# EAGLE board openvga (EAGLE 4.15), part 1 of 2
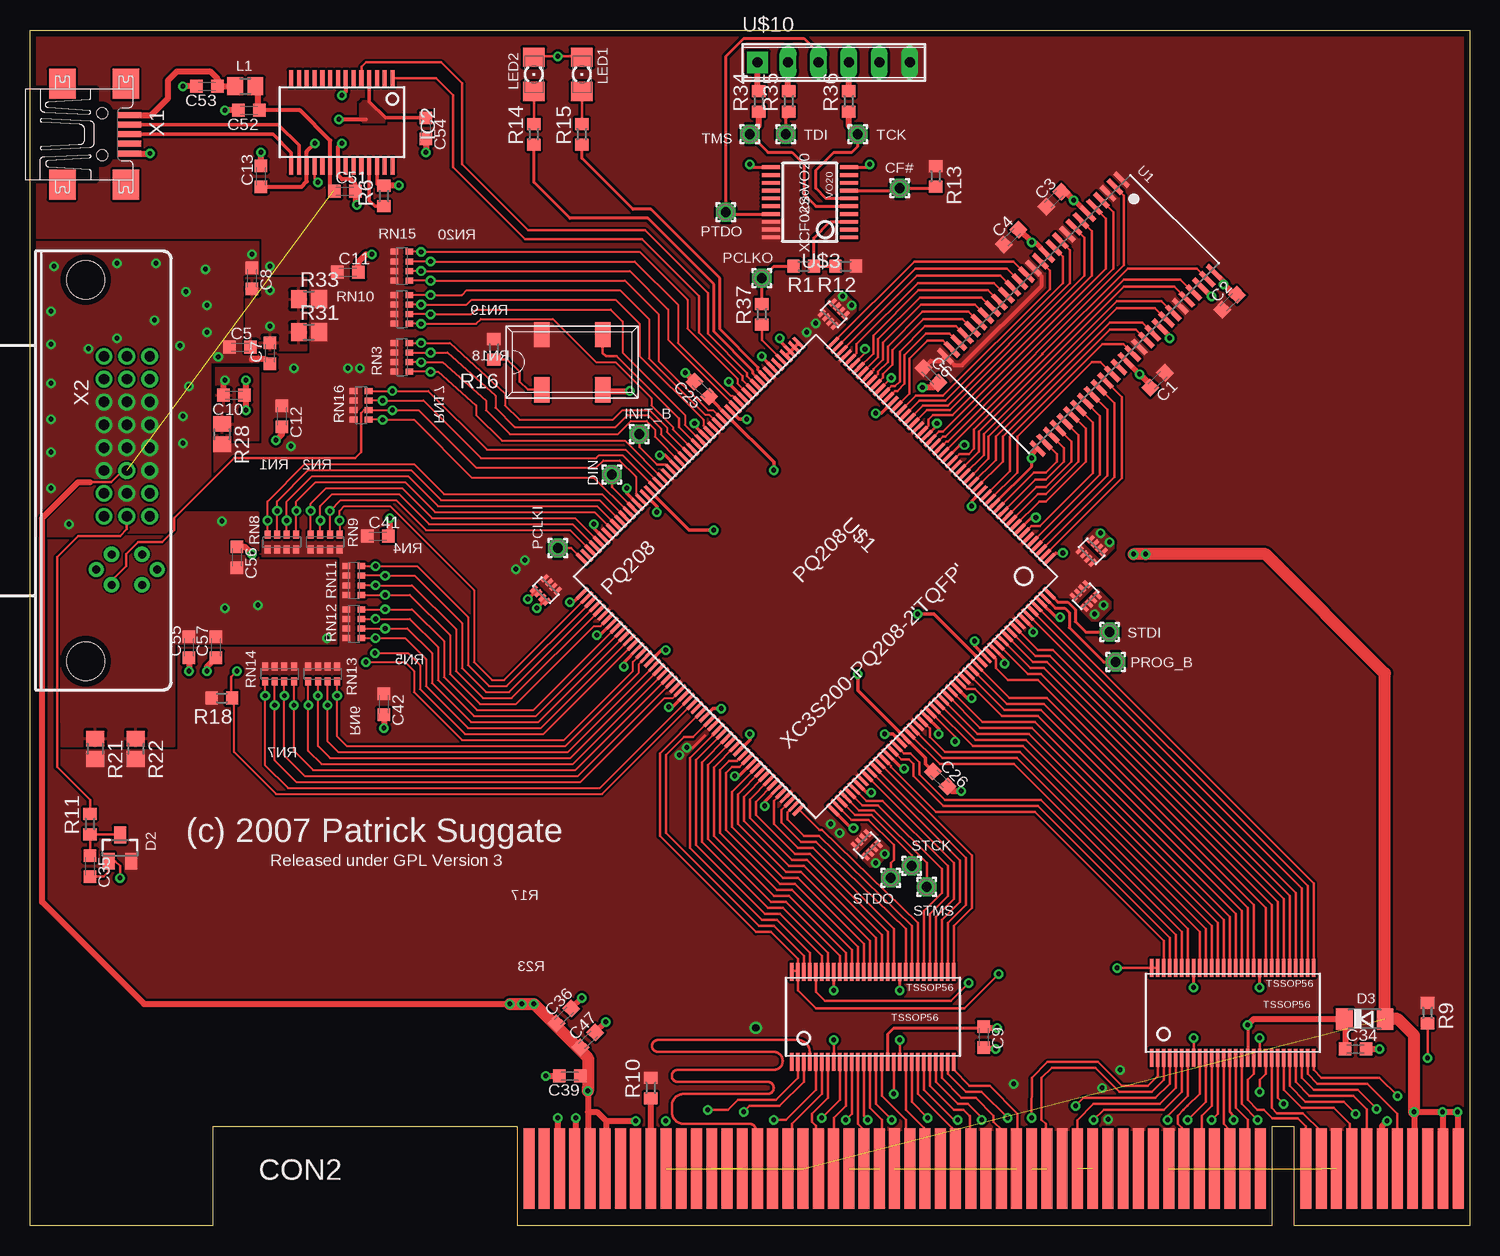
[diagram p5: board, top side]
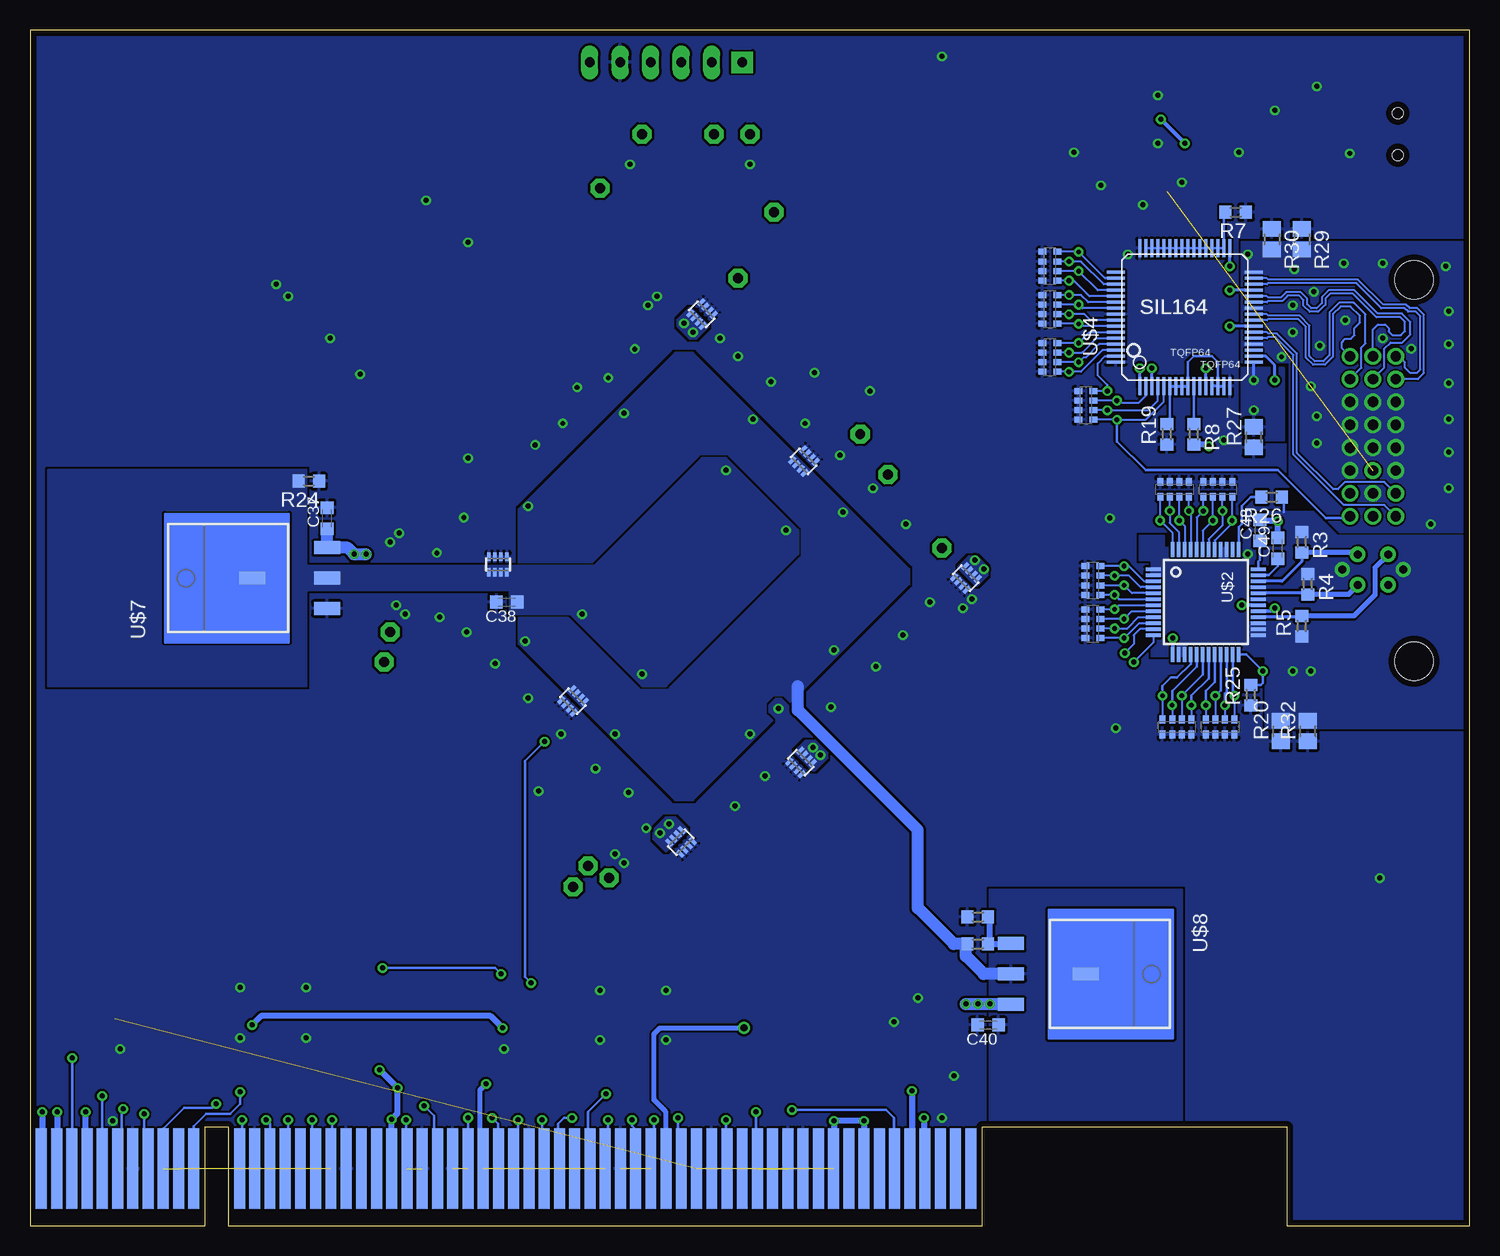
[diagram p6: board, bottom side, seen from below]

Size 120.02 x 99.69 mm. Coordinates in mm from the lower left corner, seen from the top.
Copper layers (1*16): Top 0.035mm / dielectric 1.5mm / Bottom 0.035mm
Design rules "FreeGA": minimum track width 0.15mm, minimum drill 0.4mm, track to track 0.15mm, track to pad 0.15mm, pad to pad 0.15mm, via to via 0.15mm, smd to smd 0.05mm, copper to edge 0.5mm, drill to drill 8mil, minimum pad ring 10mil, minimum via ring 8mil, stop-mask expansion 0.2mm, vias tented up to drill 0mil, thermal gap 10mil

## Footprints (pad centres in the part's own frame; a part is rotated, then mirrored left to right if it is on the bottom)
C0603K = smd 1.05 x 1.08: 1 -0.875,0; 2 0.875,0
1,6/0,8 = drill 0.813 pad 1.6 octagon: 1 0,0
CA4_0805 = smd 0.3 x 0.7: 1 -0.75,0.65; 2 -0.25,0.65; 3 0.25,0.65; 4 0.75,0.65; 5 0.75,-0.65; 6 0.25,-0.65; 7 -0.25,-0.65; 8 -0.75,-0.65
PCI_BRDL = smd 0.91 x 6.7: C1 41.593,4.763; C2 42.862,4.763; C3 44.133,4.763; C4 45.403,4.763; C5 46.672,4.763; C6 47.943,4.763; C7 49.212,4.763; C8 50.483,4.763; C9 51.752,4.763; C10 53.023,4.763; C11 54.292,4.763; C12 55.562,4.763; C13 56.833,4.763; C14 58.102,4.763; C15 59.373,4.763; C16 60.642,4.763; C17 61.913,4.763; C18 63.182,4.763; C19 64.453,4.763; C20 65.722,4.763; C21 66.993,4.763; C22 68.263,4.763; C23 69.532,4.763; C24 70.802,4.763; C25 72.073,4.763; C26 73.343,4.763; C27 74.612,4.763; C28 75.882,4.763; C29 77.153,4.763; C30 78.422,4.763; C31 79.692,4.763; C32 80.963,4.763; C33 82.233,4.763; C34 83.502,4.763; C35 84.772,4.763; C36 86.043,4.763; C37 87.312,4.763; C38 88.582,4.763; C39 89.853,4.763; C40 91.123,4.763; C41 92.392,4.763; C42 93.662,4.763; C43 94.933,4.763; C44 96.203,4.763; C45 97.472,4.763; C46 98.743,4.763; C47 100.013,4.763; C48 101.282,4.763; C49 102.552,4.763; C52 106.362,4.763; C53 107.632,4.763; C54 108.903,4.763; C55 110.172,4.763; C56 111.442,4.763; C57 112.713,4.763; C58 113.983,4.763; C59 115.252,4.763; C60 116.522,4.763; C61 117.793,4.763; C62 119.062,4.763 | smd 0.91 x 6.7 bottom: S1 41.593,4.763; S2 42.862,4.763; S3 44.133,4.763; S4 45.403,4.763; S5 46.672,4.763; S6 47.943,4.763; S7 49.212,4.763; S8 50.483,4.763; S9 51.752,4.763; S10 53.023,4.763; S11 54.292,4.763; S12 55.562,4.763; S13 56.833,4.763; S14 58.102,4.763; S15 59.373,4.763; S16 60.642,4.763; S17 61.913,4.763; S18 63.182,4.763; S19 64.453,4.763; S20 65.722,4.763; S21 66.993,4.763; S22 68.263,4.763; S23 69.532,4.763; S24 70.802,4.763; S25 72.073,4.763; S26 73.343,4.763; S27 74.612,4.763; S28 75.882,4.763; S29 77.153,4.763; S30 78.422,4.763; S31 79.692,4.763; S32 80.963,4.763; S33 82.233,4.763; S34 83.502,4.763; S35 84.772,4.763; S36 86.043,4.763; S37 87.312,4.763; S38 88.582,4.763; S39 89.853,4.763; S40 91.123,4.763; S41 92.392,4.763; S42 93.662,4.763; S43 94.933,4.763; S44 96.203,4.763; S45 97.472,4.763; S46 98.743,4.763; S47 100.013,4.763; S48 101.282,4.763; S49 102.552,4.763; S52 106.362,4.763; S53 107.632,4.763; S54 108.903,4.763; S55 110.172,4.763; S56 111.442,4.763; S57 112.713,4.763; S58 113.983,4.763; S59 115.252,4.763; S60 116.522,4.763; S61 117.793,4.763; S62 119.062,4.763
SOT23 = smd 1 x 1.4: 1 -0.95,-1.1; 2 0.95,-1.1; 3 0,1.1
SOD80C = smd 1.4 x 1.8: A 1.7,0; C -1.7,0
SSOP28DB = smd 0.348 x 1.397: 1 -4.225,-3.656; 2 -3.575,-3.656; 3 -2.925,-3.656; 4 -2.275,-3.656; 5 -1.625,-3.656; 6 -0.975,-3.656; 7 -0.325,-3.656; 8 0.325,-3.656; 9 0.975,-3.656; 10 1.625,-3.656; 11 2.275,-3.656; 12 2.925,-3.656; 13 3.575,-3.656; 14 4.225,-3.656; 15 4.225,3.656; 16 3.575,3.656; 17 2.925,3.656; 18 2.275,3.656; 19 1.625,3.656; 20 0.975,3.656; 21 0.325,3.656; 22 -0.325,3.656; 23 -0.975,3.656; 24 -1.625,3.656; 25 -2.275,3.656; 26 -2.925,3.656; 27 -3.575,3.656; 28 -4.225,3.656
R0805 = smd 1.3 x 1.5: 1 -0.85,0; 2 0.85,0
1206 = smd 1.6 x 1.803: A -1.422,0; C 1.422,0
R0603 = smd 1 x 1.1: 1 -0.85,0; 2 0.85,0
0603-ARV = smd 0.5 x 0.65: 1 -1.2,-0.625; 2 -0.4,-0.625; 3 0.4,-0.625; 4 1.2,-0.625; 5 1.2,0.625; 6 0.4,0.625; 7 -0.4,0.625; 8 -1.2,0.625
TSOP54 = smd 0.4 x 1.6: 1 -10.4,-5.45; 2 -9.6,-5.45; 3 -8.8,-5.45; 4 -8,-5.45; 5 -7.2,-5.45; 6 -6.4,-5.45; 7 -5.6,-5.45; 8 -4.8,-5.45; 9 -4,-5.45; 10 -3.2,-5.45; 11 -2.4,-5.45; 12 -1.6,-5.45; 13 -0.8,-5.45; 14 0,-5.45; 15 0.8,-5.45; 16 1.6,-5.45; 17 2.4,-5.45; 18 3.2,-5.45; 19 4,-5.45; 20 4.8,-5.45; 21 5.6,-5.45; 22 6.4,-5.45; 23 7.2,-5.45; 24 8,-5.45; 25 8.8,-5.45; 26 9.6,-5.45; 27 10.4,-5.45; 28 10.4,5.45; 29 9.6,5.45; 30 8.8,5.45; 31 8,5.45; 32 7.2,5.45; 33 6.4,5.45; 34 5.6,5.45; 35 4.8,5.45; 36 4,5.45; 37 3.2,5.45; 38 2.4,5.45; 39 1.6,5.45; 40 0.8,5.45; 41 0,5.45; 42 -0.8,5.45; 43 -1.6,5.45; 44 -2.4,5.45; 45 -3.2,5.45; 46 -4,5.45; 47 -4.8,5.45; 48 -5.6,5.45; 49 -6.4,5.45; 50 -7.2,5.45; 51 -8,5.45; 52 -8.8,5.45; 53 -9.6,5.45; 54 -10.4,5.45
PQ208 = smd 1.3 x 0.28: P1 -14.5,13; P2 -14.5,12.5; P3 -14.5,12; P4 -14.5,11.5; P5 -14.5,11; P6 -14.5,10.5; P7 -14.5,10; P8 -14.5,9.5; P9 -14.5,9; P10 -14.5,8.5; P11 -14.5,8; P12 -14.5,7.5; P13 -14.5,7; P14 -14.5,6.5; P15 -14.5,6; P16 -14.5,5.5; P17 -14.5,5; P18 -14.5,4.5; P19 -14.5,4; P20 -14.5,3.5; P21 -14.5,3; P22 -14.5,2.5; P23 -14.5,2; P24 -14.5,1.5; P25 -14.5,1; P26 -14.5,0.5; P27 -14.5,0; P28 -14.5,-0.5; P29 -14.5,-1; P30 -14.5,-1.5; P31 -14.5,-2; P32 -14.5,-2.5; P33 -14.5,-3; P34 -14.5,-3.5; P35 -14.5,-4; P36 -14.5,-4.5; P37 -14.5,-5; P38 -14.5,-5.5; P39 -14.5,-6; P40 -14.5,-6.5; P41 -14.5,-7; P42 -14.5,-7.5; P43 -14.5,-8; P44 -14.5,-8.5; P45 -14.5,-9; P46 -14.5,-9.5; P47 -14.5,-10; P48 -14.5,-10.5; P49 -14.5,-11; P50 -14.5,-11.5; P51 -14.5,-12; P52 -14.5,-12.5; P105 15,-12.5; P106 15,-12; P107 15,-11.5; P108 15,-11; P109 15,-10.5; P110 15,-10; P111 15,-9.5; P112 15,-9; P113 15,-8.5; P114 15,-8; P115 15,-7.5; P116 15,-7; P117 15,-6.5; P118 15,-6; P119 15,-5.5; P120 15,-5; P121 15,-4.5; P122 15,-4; P123 15,-3.5; P124 15,-3; P125 15,-2.5; P126 15,-2; P127 15,-1.5; P128 15,-1; P129 15,-0.5; P130 15,0; P131 15,0.5; P132 15,1; P133 15,1.5; P134 15,2; P135 15,2.5; P136 15,3; P137 15,3.5; P138 15,4; P139 15,4.5; P140 15,5; P141 15,5.5; P142 15,6; P143 15,6.5; P144 15,7; P145 15,7.5; P146 15,8; P147 15,8.5; P148 15,9; P149 15,9.5; P150 15,10; P151 15,10.5; P152 15,11; P153 15,11.5; P154 15,12; P155 15,12.5; P156 15,13 | smd 0.28 x 1.3: P53 -12.5,-14.5; P54 -12,-14.5; P55 -11.5,-14.5; P56 -11,-14.5; P57 -10.5,-14.5; P58 -10,-14.5; P59 -9.5,-14.5; P60 -9,-14.5; P61 -8.5,-14.5; P62 -8,-14.5; P63 -7.5,-14.5; P64 -7,-14.5; P65 -6.5,-14.5; P66 -6,-14.5; P67 -5.5,-14.5; P68 -5,-14.5; P69 -4.5,-14.5; P70 -4,-14.5; P71 -3.5,-14.5; P72 -3,-14.5; P73 -2.5,-14.5; P74 -2,-14.5; P75 -1.5,-14.5; P76 -1,-14.5; P77 -0.5,-14.5; P78 0,-14.5; P79 0.5,-14.5; P80 1,-14.5; P81 1.5,-14.5; P82 2,-14.5; P83 2.5,-14.5; P84 3,-14.5; P85 3.5,-14.5; P86 4,-14.5; P87 4.5,-14.5; P88 5,-14.5; P89 5.5,-14.5; P90 6,-14.5; P91 6.5,-14.5; P92 7,-14.5; P93 7.5,-14.5; P94 8,-14.5; P95 8.5,-14.5; P96 9,-14.5; P97 9.5,-14.5; P98 10,-14.5; P99 10.5,-14.5; P100 11,-14.5; P101 11.5,-14.5; P102 12,-14.5; P103 12.5,-14.5; P104 13,-14.5; P157 13,15; P158 12.5,15; P159 12,15; P160 11.5,15; P161 11,15; P162 10.5,15; P163 10,15; P164 9.5,15; P165 9,15; P166 8.5,15; P167 8,15; P168 7.5,15; P169 7,15; P170 6.5,15; P171 6,15; P172 5.5,15; P173 5,15; P174 4.5,15; P175 4,15; P176 3.5,15; P177 3,15; P178 2.5,15; P179 2,15; P180 1.5,15; P181 1,15; P182 0.5,15; P183 0,15; P184 -0.5,15; P185 -1,15; P186 -1.5,15; P187 -2,15; P188 -2.5,15; P189 -3,15; P190 -3.5,15; P191 -4,15; P192 -4.5,15; P193 -5,15; P194 -5.5,15; P195 -6,15; P196 -6.5,15; P197 -7,15; P198 -7.5,15; P199 -8,15; P200 -8.5,15; P201 -9,15; P202 -9.5,15; P203 -10,15; P204 -10.5,15; P205 -11,15; P206 -11.5,15; P207 -12,15; P208 -12.5,15
LQFP-48 = smd 0.3 x 1.25: 1 -2.75,-4.375; 2 -2.25,-4.375; 3 -1.75,-4.375; 4 -1.25,-4.375; 5 -0.75,-4.375; 6 -0.25,-4.375; 7 0.25,-4.375; 8 0.75,-4.375; 9 1.25,-4.375; 10 1.75,-4.375; 11 2.25,-4.375; 12 2.75,-4.375; 25 2.75,4.375; 26 2.25,4.375; 27 1.75,4.375; 28 1.25,4.375; 29 0.75,4.375; 30 0.25,4.375; 31 -0.25,4.375; 32 -0.75,4.375; 33 -1.25,4.375; 34 -1.75,4.375; 35 -2.25,4.375; 36 -2.75,4.375 | smd 1.25 x 0.3: 13 4.375,-2.75; 14 4.375,-2.25; 15 4.375,-1.75; 16 4.375,-1.25; 17 4.375,-0.75; 18 4.375,-0.25; 19 4.375,0.25; 20 4.375,0.75; 21 4.375,1.25; 22 4.375,1.75; 23 4.375,2.25; 24 4.375,2.75; 37 -4.375,2.75; 38 -4.375,2.25; 39 -4.375,1.75; 40 -4.375,1.25; 41 -4.375,0.75; 42 -4.375,0.25; 43 -4.375,-0.25; 44 -4.375,-0.75; 45 -4.375,-1.25; 46 -4.375,-1.75; 47 -4.375,-2.25; 48 -4.375,-2.75
VO20 = smd 0.32 x 1.5: P1 -2.6,-3.25; P2 -1.95,-3.25; P3 -1.3,-3.25; P4 -0.65,-3.25; P5 0,-3.25; P6 0.65,-3.25; P7 1.3,-3.25; P8 1.95,-3.25; P9 2.6,-3.25; P10 3.25,-3.25; P11 3.25,3.25; P12 2.6,3.25; P13 1.95,3.25; P14 1.3,3.25; P15 0.65,3.25; P16 0,3.25; P17 -0.65,3.25; P18 -1.3,3.25; P19 -1.95,3.25; P20 -2.6,3.25
TQFP64 = smd 0.25 x 1.5: P1 -4,-5.5; P2 -3.5,-5.5; P3 -3,-5.5; P4 -2.5,-5.5; P5 -2,-5.5; P6 -1.5,-5.5; P7 -1,-5.5; P8 -0.5,-5.5; P9 0,-5.5; P10 0.5,-5.5; P11 1,-5.5; P12 1.5,-5.5; P13 2,-5.5; P14 2.5,-5.5; P15 3,-5.5; P16 3.5,-5.5; P33 3.5,6; P34 3,6; P35 2.5,6; P36 2,6; P37 1.5,6; P38 1,6; P39 0.5,6; P40 0,6; P41 -0.5,6; P42 -1,6; P43 -1.5,6; P44 -2,6; P45 -2.5,6; P46 -3,6; P47 -3.5,6; P48 -4,6 | smd 1.5 x 0.25: P17 5.5,-3.5; P18 5.5,-3; P19 5.5,-2.5; P20 5.5,-2; P21 5.5,-1.5; P22 5.5,-1; P23 5.5,-0.5; P24 5.5,0; P25 5.5,0.5; P26 5.5,1; P27 5.5,1.5; P28 5.5,2; P29 5.5,2.5; P30 5.5,3; P31 5.5,3.5; P32 5.5,4; P49 -6,4; P50 -6,3.5; P51 -6,3; P52 -6,2.5; P53 -6,2; P54 -6,1.5; P55 -6,1; P56 -6,0.5; P57 -6,0; P58 -6,-0.5; P59 -6,-1; P60 -6,-1.5; P61 -6,-2; P62 -6,-2.5; P63 -6,-3; P64 -6,-3.5
TSSOP56 = smd 1.524 x 0.254: P1 -5.5,7.5; P2 -5.5,7; P3 -5.5,6.5; P4 -5.5,6; P5 -5.5,5.5; P6 -5.5,5; P7 -5.5,4.5; P8 -5.5,4; P9 -5.5,3.5; P10 -5.5,3; P11 -5.5,2.5; P12 -5.5,2; P13 -5.5,1.5; P14 -5.5,1; P15 -5.5,0.5; P16 -5.5,0; P17 -5.5,-0.5; P18 -5.5,-1; P19 -5.5,-1.5; P20 -5.5,-2; P21 -5.5,-2.5; P22 -5.5,-3; P23 -5.5,-3.5; P24 -5.5,-4; P25 -5.5,-4.5; P26 -5.5,-5; P27 -5.5,-5.5; P28 -5.5,-6; P29 2,-6; P30 2,-5.5; P31 2,-5; P32 2,-4.5; P33 2,-4; P34 2,-3.5; P35 2,-3; P36 2,-2.5; P37 2,-2; P38 2,-1.5; P39 2,-1; P40 2,-0.5; P41 2,0; P42 2,0.5; P43 2,1; P44 2,1.5; P45 2,2; P46 2,2.5; P47 2,3; P48 2,3.5; P49 2,4; P50 2,4.5; P51 2,5; P52 2,5.5; P53 2,6; P54 2,6.5; P55 2,7; P56 2,7.5
TO-263 = smd 2.159 x 1.067: P1 6.24,2.54; P2_0 6.24,0; P2_1 0,0; P3 6.24,-2.54
SG-8002JC = smd 1.3 x 2.1: P1 -2.54,-2.3; P2 2.54,-2.3; P3 2.54,2.3; P4 -2.54,2.3
JTAG-SIL = drill 0.813 pad 1.778 square: P1 -6.35,0 | drill 0.813 pad 1.422 long: P2 -3.81,0; P3 -1.27,0; P4 1.27,0; P5 3.81,0; P6 6.35,0
UX60-MB-5ST = smd 2 x 0.5: 1 2.25,1.6; 2 2.25,0.8; 3 2.25,0; 4 2.25,-0.8; 5 2.25,-1.6 | smd 2.2 x 2.5: M1 -3.3,-4.2; M2 -3.3,4.2; M3 2,4.2; M4 2,-4.2 | hole 0.9: 0,-1.75; 0,1.75
DVI-I-R = drill 0.864 pad 1.397 round: 1 -9.525,6.985; 2 -7.62,6.985; 3 -5.715,6.985; 4 -3.81,6.985; 5 -1.905,6.985; 6 0,6.985; 7 1.905,6.985; 8 3.81,6.985; 9 -9.525,5.08; 10 -7.62,5.08; 11 -5.715,5.08; 12 -3.81,5.08; 13 -1.905,5.08; 14 0,5.08; 15 1.905,5.08; 16 3.81,5.08; 17 -9.525,3.175; 18 -7.62,3.175; 19 -5.715,3.175; 20 -3.81,3.175; 21 -1.905,3.175; 22 0,3.175; 23 1.905,3.175; 24 3.81,3.175 | drill 0.66 pad 1.27 round: C1 6.985,6.35; C2 9.525,6.35; C3 6.985,3.81; C4 9.525,3.81; C5 8.255,2.54; C6 8.255,7.62 | hole 3.175: -15.9,1.651; 15.9,1.651

## Placement (x,y rotation side)
C1  100n  [C0603K]  94,70.5 225 top
C2  100n  [C0603K]  100,77 45 top
C3  100n  [C0603K]  85.36,85.59 45 top
C4  100n  [C0603K]  81.79,82.43 45 top
C5  100n  [C0603K]  17.5,73.25 0 top
C6  100n  [C0603K]  75.1,70.9 315 top
C7  100n  [C0603K]  20,72.75 90 top
C8  4u7  [C0603K]  18.5,79 270 top
C9  100n  [C0603K]  79.5,15.75 270 top
C10  100n  [C0603K]  17,69.25 180 top
C11  100n  [C0603K]  26.5,79.5 0 top
C12  100n  [C0603K]  21,67.5 270 top
C13  100n  [C0603K]  19.25,87.5 90 top
C25  100n  [C0603K]  56,69.75 135 top
C26  100n  [C0603K]  75.88,37.25 315 top
C34  4u7  [C0603K]  110.5,14.75 0 top
C35  ???  [C0603K]  5,30 270 top
C36  4u7  [C0603K]  44.5,17.5 45 top
C37  4u7  [C0603K]  95.25,59 90 bottom
C38  4u7  [C0603K]  80.25,52 180 bottom
C39  4u7  [C0603K]  45,12.5 180 top
C40  4u7  [C0603K]  40.15,16.75 180 bottom
C41  100n  [C0603K]  29,57.5 0 top
C42  100n  [C0603K]  29.5,43.5 270 top
C47  4u7  [C0603K]  46.5,15.5 45 top
C48  100n  [C0603K]  17.5,58 90 bottom
C49  100n  [C0603K]  16,56.5 90 bottom
C51  100n  [C0603K]  26.25,86.25 0 top
C52  4u7  [C0603K]  18.25,93 180 top
C53  10n  [C0603K]  14.75,95 180 top
C54  100n  [C0603K]  33,91.5 270 top
C55  100n  [C0603K]  13.25,48.25 90 top
C56  100n  [C0603K]  17.25,55.75 270 top
C57  4u7  [C0603K]  15.5,48.25 90 top
CF#  [1,6/0,8]  72.5,86.5 0 top
CN1  100n  [CA4_0805]  88.5,56.25 135 top
CN2  100n  [CA4_0805]  67,76 135 top
CN3  100n  [CA4_0805]  81,55.12 180 bottom
CN4  100n  [CA4_0805]  43,53 315 top
CN5  100n  [CA4_0805]  69.75,31.75 45 top
CN6  100n  [CA4_0805]  55.5,63.75 135 bottom
CN7  100n  [CA4_0805]  74.75,43.75 315 bottom
CN8  100n  [CA4_0805]  88,52.5 45 top
CN9  100n  [CA4_0805]  42,54 315 bottom
CN10  100n  [CA4_0805]  55.75,38.62 315 bottom
CN11  100n  [CA4_0805]  65.75,32 45 bottom
CN12  100n  [CA4_0805]  64,76 135 bottom
CON2  [PCI_BRDL]  0,0 0 top
D2  BAS70-04  [SOT23]  7.5,31.5 0 top
D3  [SOD80C]  111.25,17.25 0 top
DIN  [1,6/0,8]  48.5,62.62 0 top
IC2  FT232RL  [SSOP28DB]  26,92 180 top
INIT_B  [1,6/0,8]  50.8,66 0 top
L1  40R0_100  [R0805]  17.95,95 0 top
LED1  [1206]  46,96 90 top
LED2  [1206]  42,96 90 top
PCLKI  [1,6/0,8]  44,56.5 0 top
PCLKO  [1,6/0,8]  61,79 0 top
PROG_B  [1,6/0,8]  90.5,47 180 top
PTDO  [1,6/0,8]  58,84.5 0 top
R1  200  [R0603]  64.5,80 180 top
R3  75  [R0603]  14,57 270 bottom
R4  75  [R0603]  13.5,53.5 270 bottom
R5  75  [R0603]  14,50 90 bottom
R6  0r0  [R0603]  29.5,85.85 90 top
R7  470  [R0603]  19.5,84.5 180 bottom
R8  4k7  [R0603]  23,66 270 bottom
R9  4k7  [R0603]  116.5,17.75 270 top
R10  4k7  [R0603]  51.75,11.5 90 top
R11  1k  [R0603]  5,33.5 90 top
R12  4k7  [R0603]  68,80 180 top
R13  4k7  [R0603]  75.5,87.5 270 top
R14  220  [R0603]  42,91 90 top
R15  220  [R0603]  46,91 90 top
R16  4k7  [R0603]  38.67,73.07 270 top
R17  [R0603]  41,25.75 0 bottom
R18  220  [R0603]  16,44 180 top
R19  1k  [R0603]  25.25,66 90 bottom
R20  L120  [R0805]  15.75,41.25 90 bottom
R21  L120  [R0805]  5.44,39.77 270 top
R22  L120  [R0805]  8.82,39.77 270 top
R23  [R0603]  41,23.5 180 bottom
R24  1k  [R0603]  96.77,62.08 180 bottom
R25  220  [R0603]  18.25,44.25 90 bottom
R26  560  [R0603]  16.5,60.75 180 bottom
R27  L120  [R0805]  18,65.75 90 bottom
R28  L120  [R0805]  16,66 270 top
R29  L120  [R0805]  14,82.25 270 bottom
R30  L120  [R0805]  16.5,82.25 270 bottom
R31  L120  [R0805]  23.25,74.5 0 top
R32  L120  [R0805]  13.5,41.25 90 bottom
R33  L120  [R0805]  23.25,77.25 0 top
R34  100  [R0603]  60.75,93.75 90 top
R35  100  [R0603]  63.25,93.75 90 top
R36  100  [R0603]  68.25,93.75 90 top
R37  200  [R0603]  61,76 90 top
RN1  4R-N0603-ARV  [0603-ARV]  21,61.4 180 bottom
RN2  4R-N0603-ARV  [0603-ARV]  24.6,61.4 180 bottom
RN3  4R-N0603-ARV  [0603-ARV]  31,72.4 270 top
RN4  4R-N0603-ARV  [0603-ARV]  31.4,53.8 270 bottom
RN5  4R-N0603-ARV  [0603-ARV]  31.4,50.2 270 bottom
RN6  4R-N0603-ARV  [0603-ARV]  24.4,41.6 0 bottom
RN7  4R-N0603-ARV  [0603-ARV]  20.8,41.6 0 bottom
RN8  4R-N0603-ARV  [0603-ARV]  21,57 180 top
RN9  4R-N0603-ARV  [0603-ARV]  24.6,57 180 top
RN10  4R-N0603-ARV  [0603-ARV]  31,76.4 270 top
RN11  4R-N0603-ARV  [0603-ARV]  27,53.8 90 top
RN12  4R-N0603-ARV  [0603-ARV]  27,50.2 90 top
RN13  4R-N0603-ARV  [0603-ARV]  24.4,46 0 top
RN14  4R-N0603-ARV  [0603-ARV]  20.8,46 0 top
RN15  4R-N0603-ARV  [0603-ARV]  31,80 270 top
RN16  4R-N0603-ARV  [0603-ARV]  27.6,68.4 270 top
RN17  4R-N0603-ARV  [0603-ARV]  32,68.4 90 bottom
RN18  4R-N0603-ARV  [0603-ARV]  35,72.4 90 bottom
RN19  4R-N0603-ARV  [0603-ARV]  35,76.4 90 bottom
RN20  4R-N0603-ARV  [0603-ARV]  35,80 90 bottom
STCK  [1,6/0,8]  73.5,30 90 top
STDI  [1,6/0,8]  90,49.5 180 top
STDO  [1,6/0,8]  71.75,29 90 top
STMS  [1,6/0,8]  74.75,28.25 90 top
TCK  [1,6/0,8]  69,91 0 top
TDI  [1,6/0,8]  63,91 90 top
TMS  [1,6/0,8]  60,91 0 top
U1  K4S561632E-TC60/75  [TSOP54]  87.5,76 225 top
U$1  XC3S200-PQ208-2'TQFP'  [PQ208]  65.5,54.5 225 top
U$2  TDA8777  [LQFP-48]  22,52 270 bottom
U$3  XCF02S-VO20  [VO20]  65,85 90 top
U$4  SIL164  [TQFP64]  23.5,75.5 0 bottom
U$5  CBT16211DDG  [TSSOP56]  71,19.17 90 top
U$6  CBT16211DDG  [TSSOP56]  101,19.5 90 top
U$7  LM1086CS-2.5  [TO-263]  101.5,54 0 bottom
U$8  LM1086IS-ADJ  [TO-263]  32,21 180 bottom
U$9  SG-8002JA  [SG-8002JC]  45.2,72 0 top
U$10  JTAG-SIL  [JTAG-SIL]  67,97 0 top
X1  MINI-USB-UX60-MB-5ST  [UX60-MB-5ST]  6,91 0 top
X2  [DVI-I-R]  2.99,62.97 270 top